# Altium schematic sheet esp32_watch_main.SchDoc
size A3
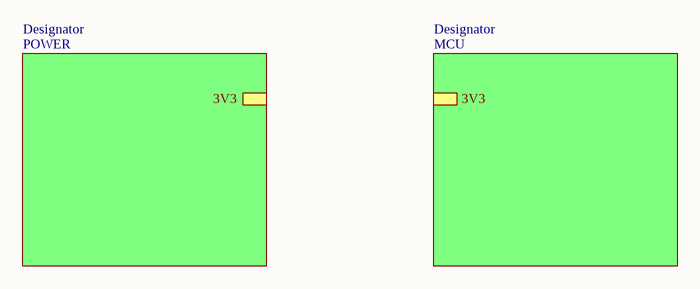
[diagram p0: esp32_watch_main.SchDoc]

## Sub-sheets
Designator = POWER: 3V3
Designator = MCU: 3V3